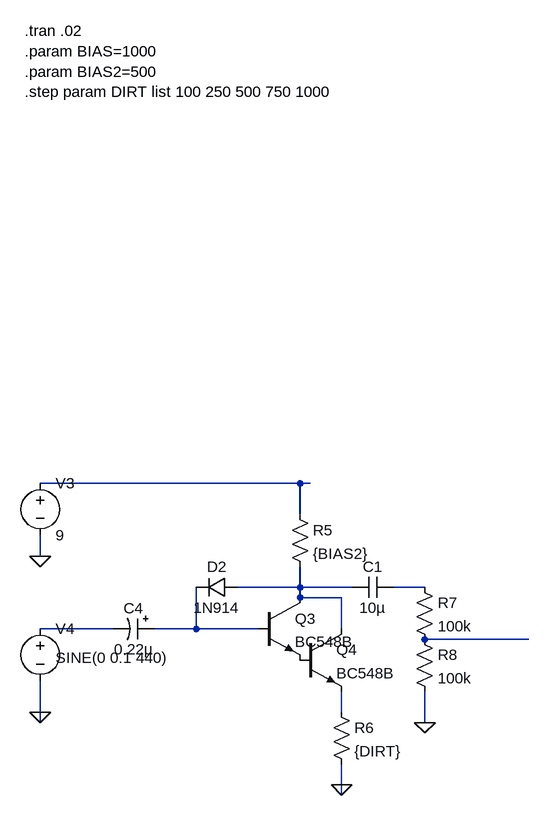
[diagram p0: schematic bass-fuzz.asc]
bass-fuzz.asc, the LTspice schematic file:
Version 4
SHEET 1 880 996
WIRE 288 496 -112 496
WIRE 304 496 288 496
WIRE 288 544 288 496
WIRE -112 608 -112 576
WIRE 288 656 288 624
WIRE 288 656 192 656
WIRE 368 656 288 656
WIRE 480 656 432 656
WIRE 288 672 288 656
WIRE 352 672 288 672
WIRE 0 720 -112 720
WIRE 128 720 128 656
WIRE 128 720 64 720
WIRE 224 720 128 720
WIRE 352 720 352 672
WIRE 640 736 480 736
WIRE -112 848 -112 800
WIRE 352 848 352 816
WIRE -112 864 -112 848
WIRE 480 864 480 816
WIRE 352 960 352 928
WIRE 352 976 352 960
FLAG -112 608 0
FLAG 352 960 0
FLAG -112 848 0
FLAG 480 864 0
SYMBOL voltage -112 480 R0
SYMATTR InstName V3
SYMATTR Value 9
SYMBOL res 272 528 R0
SYMATTR InstName R5
SYMATTR Value {BIAS2}
SYMBOL res 336 832 R0
SYMATTR InstName R6
SYMATTR Value {DIRT}
SYMBOL diode 192 640 R90
WINDOW 0 0 32 VBottom 2
WINDOW 3 32 32 VTop 2
SYMATTR InstName D2
SYMATTR Value 1N914
SYMBOL voltage -112 704 R0
WINDOW 3 24 60 Left 2
WINDOW 123 24 38 Left 2
SYMATTR Value SINE(0 0.1 440)
SYMATTR InstName V4
SYMBOL cap 432 640 R90
WINDOW 0 0 32 VBottom 2
WINDOW 3 32 32 VTop 2
SYMATTR InstName C1
SYMATTR Value 10µ
SYMBOL res 464 640 R0
SYMATTR InstName R7
SYMATTR Value 100k
SYMBOL npn 224 672 R0
SYMATTR InstName Q3
SYMATTR Value BC548B
SYMBOL npn 288 720 R0
SYMATTR InstName Q4
SYMATTR Value BC548B
SYMBOL res 464 720 R0
SYMATTR InstName R8
SYMATTR Value 100k
SYMBOL polcap 64 704 R90
WINDOW 0 0 32 VBottom 2
WINDOW 3 32 32 VTop 2
SYMATTR InstName C4
SYMATTR Value 0.22µ
TEXT -136 -200 Left 2 !.tran .02\n.param BIAS=1000\n.param BIAS2=500\n.step param DIRT list 100 250 500 750 1000

The netlist it stands for:
* bass-fuzz.asc
V3 N001 0 9
R5 N001 N002 {BIAS2}
R6 N007 0 {DIRT}
D2 N002 N005 1N914
V4 N004 0 SINE(0 0.1 440)
C1 N003 N002 10µ
R7 N003 N006 100k
Q3 N002 N005 P001 0 BC548B
Q4 N002 P001 N007 0 BC548B
R8 N006 0 100k
C4 N005 N004 0.22µ
.model D D
.lib standard.dio
.model NPN NPN
.model PNP PNP
.lib standard.bjt
.tran .02
.param BIAS=1000
.param BIAS2=500
.step param DIRT list 100 250 500 750 1000
.backanno
.end